# EAGLE schematic ADC channel 4 (EAGLE 9.6.2)
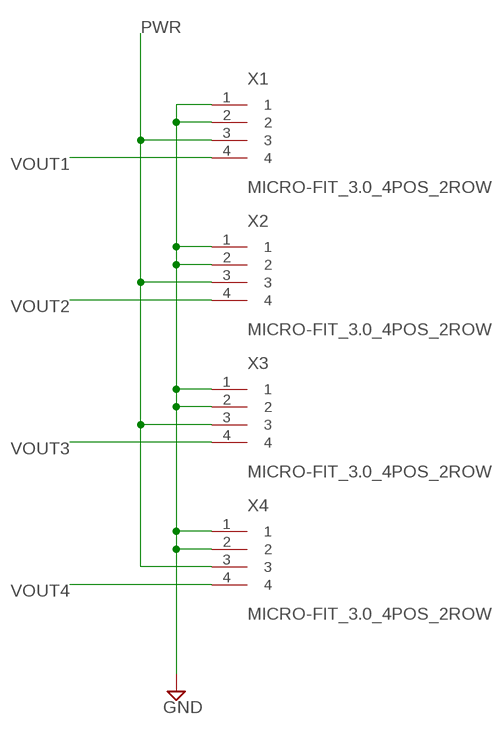
[diagram p0: schematic, sheet 1]

## Parts
X1  MICRO-FIT_3.0_4POS_2ROW  [0430450412]
X2  MICRO-FIT_3.0_4POS_2ROW  [0430450412]
X3  MICRO-FIT_3.0_4POS_2ROW  [0430450412]
X4  MICRO-FIT_3.0_4POS_2ROW  [0430450412]

## Nets
GND: X1.1 X1.2 X2.1 X2.2 X3.1 X3.2 X4.1 X4.2
PWR: X1.3 X2.3 X3.3 X4.3
VOUT1: X1.4
VOUT2: X2.4
VOUT3: X3.4
VOUT4: X4.4

## Library data of the parts
X1-X4 = gtsr-connector:MICRO-FIT_3.0_4POS; MANUFACTURER: Molex; MFPN: 0430450412; SUPPLIER: Digi-Key; SUPPLIER_PN: WM1790-ND